# EAGLE design ardumsx (EAGLE 9.0.1)
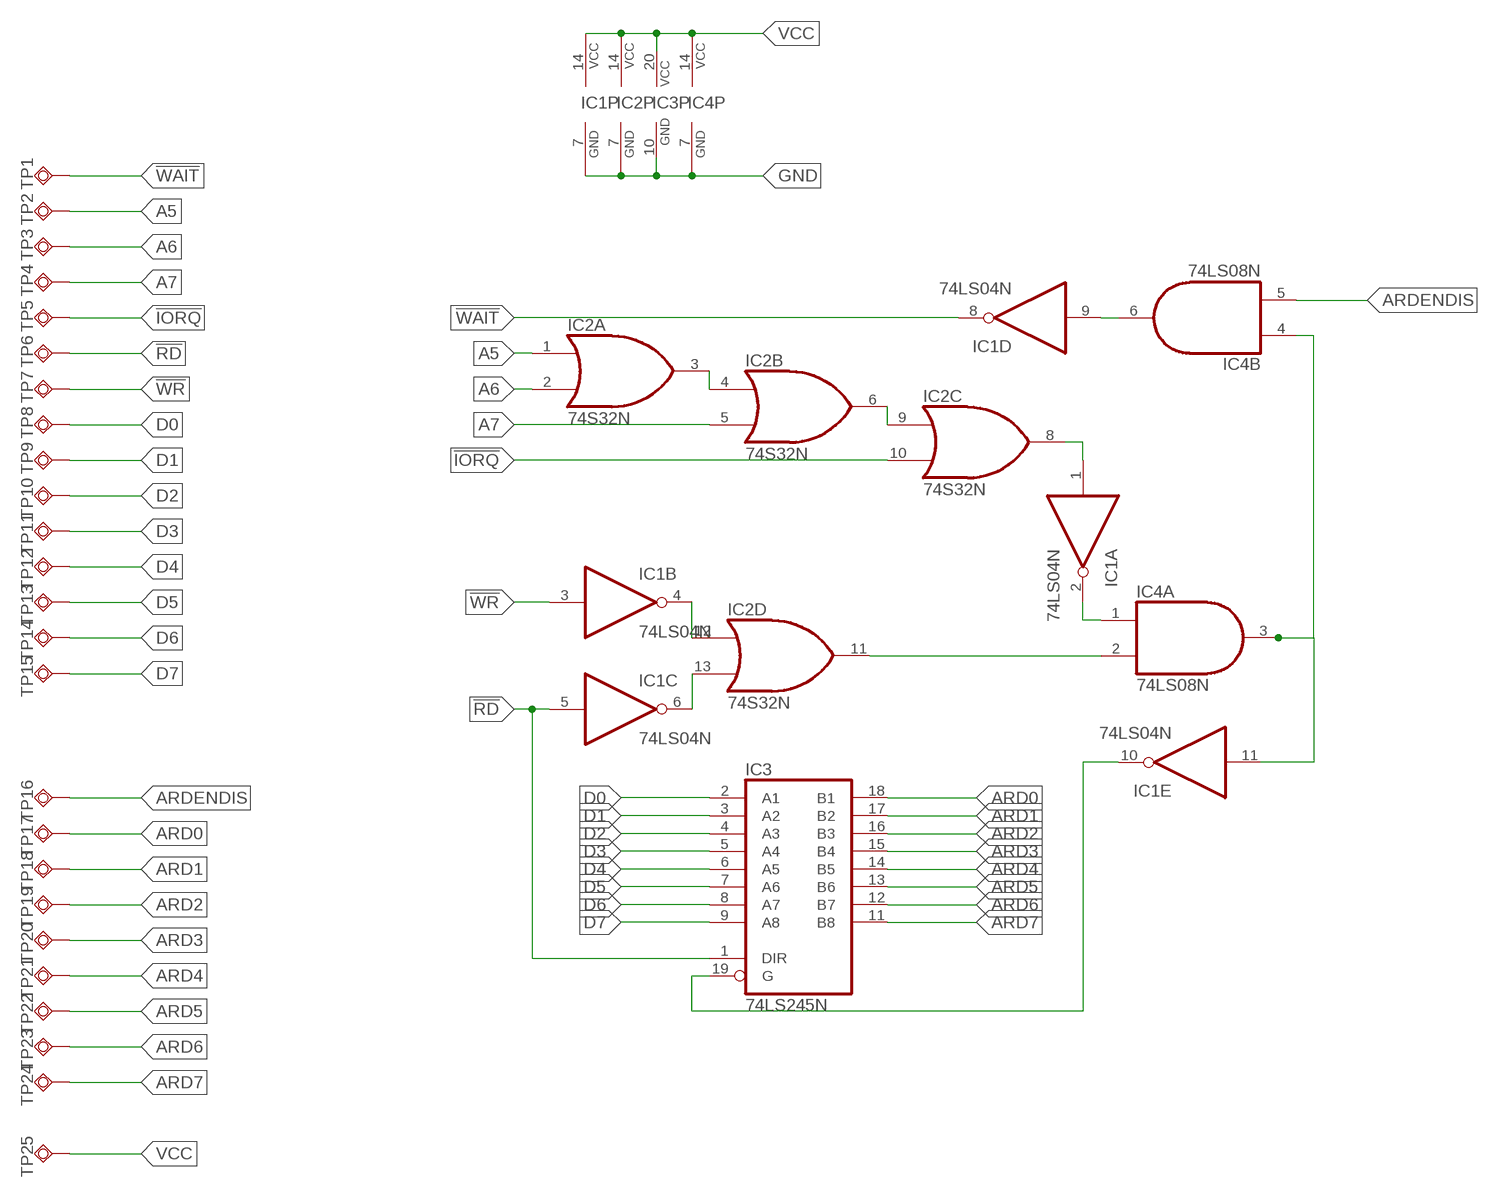
[diagram p0: schematic, sheet 1]

## Parts
IC1  74LS04N  [DIL14]
IC2  74S32N  [DIL14]
IC3  74LS245N  [DIL20]
IC4  74LS08N  [DIL14]
TP1  TPSQTP17R  [TP17R]
TP2  TPSQTP17R  [TP17R]
TP3  TPSQTP17R  [TP17R]
TP4  TPSQTP17R  [TP17R]
TP5  TPSQTP17R  [TP17R]
TP6  TPSQTP17R  [TP17R]
TP7  TPSQTP17R  [TP17R]
TP8  TPSQTP17R  [TP17R]
TP9  TPSQTP17R  [TP17R]
TP10  TPSQTP17R  [TP17R]
TP11  TPSQTP17R  [TP17R]
TP12  TPSQTP17R  [TP17R]
TP13  TPSQTP17R  [TP17R]
TP14  TPSQTP17R  [TP17R]
TP15  TPSQTP17R  [TP17R]
TP16  TPSQTP17R  [TP17R]
TP17  TPSQTP17R  [TP17R]
TP18  TPSQTP17R  [TP17R]
TP19  TPSQTP17R  [TP17R]
TP20  TPSQTP17R  [TP17R]
TP21  TPSQTP17R  [TP17R]
TP22  TPSQTP17R  [TP17R]
TP23  TPSQTP17R  [TP17R]
TP24  TPSQTP17R  [TP17R]
TP25  TPSQTP17R  [TP17R]

## Nets
!ENABLE: IC1.10(E:O) IC3.19(G)
!IORQ: IC2.10(C:I1) TP5.TP
!RD: IC1.5(C:I) IC3.1(DIR) TP6.TP
!WAIT: IC1.8(D:O) TP1.TP
!WR: IC1.3(B:I) TP7.TP
A5: IC2.1(A:I0) TP2.TP
A6: IC2.2(A:I1) TP3.TP
A7: IC2.5(B:I1) TP4.TP
ARD0: IC3.18(B1) TP17.TP
ARD1: IC3.17(B2) TP18.TP
ARD2: IC3.16(B3) TP19.TP
ARD3: IC3.15(B4) TP20.TP
ARD4: IC3.14(B5) TP21.TP
ARD5: IC3.13(B6) TP22.TP
ARD6: IC3.12(B7) TP23.TP
ARD7: IC3.11(B8) TP24.TP
ARDENDIS: IC4.5(B:I1) TP16.TP
D0: IC3.2(A1) TP8.TP
D1: IC3.3(A2) TP9.TP
D2: IC3.4(A3) TP10.TP
D3: IC3.5(A4) TP11.TP
D4: IC3.6(A5) TP12.TP
D5: IC3.7(A6) TP13.TP
D6: IC3.8(A7) TP14.TP
D7: IC3.9(A8) TP15.TP
GND: IC1.7(P:GND) IC2.7(P:GND) IC3.10(GND) IC4.7(P:GND)
N$3: IC2.3(A:O) IC2.4(B:I0)
N$5: IC2.6(B:O) IC2.9(C:I0)
N$7: IC1.1(A:I) IC2.8(C:O)
N$10: IC1.4(B:O) IC2.12(D:I0)
N$11: IC1.6(C:O) IC2.13(D:I1)
N$12: IC1.2(A:O) IC4.1(A:I0)
N$13: IC2.11(D:O) IC4.2(A:I1)
N$14: IC1.11(E:I) IC4.3(A:O) IC4.4(B:I0)
N$15: IC1.9(D:I) IC4.6(B:O)
VCC: IC1.14(P:VCC) IC2.14(P:VCC) IC3.20(VCC) IC4.14(P:VCC) TP25.TP
Unconnected: IC1.12(F:O) IC1.13(F:I) IC4.8(C:O) IC4.9(C:I0) IC4.10(C:I1) IC4.11(D:O) IC4.12(D:I0) IC4.13(D:I1)

## Library data of the parts
IC1 = 74xx-us:74*04: Hex INVERTER
IC2 = 74xx-us:74*32: Quad 2-input OR gate
IC3 = 74xx-eu:74*245: Octal BUS TRANSCEIVER, 3-state
IC4 = 74xx-us:74*08: Quad 2-input AND gate
TP1-TP25 = testpad:TPSQ: Test pad

## Board
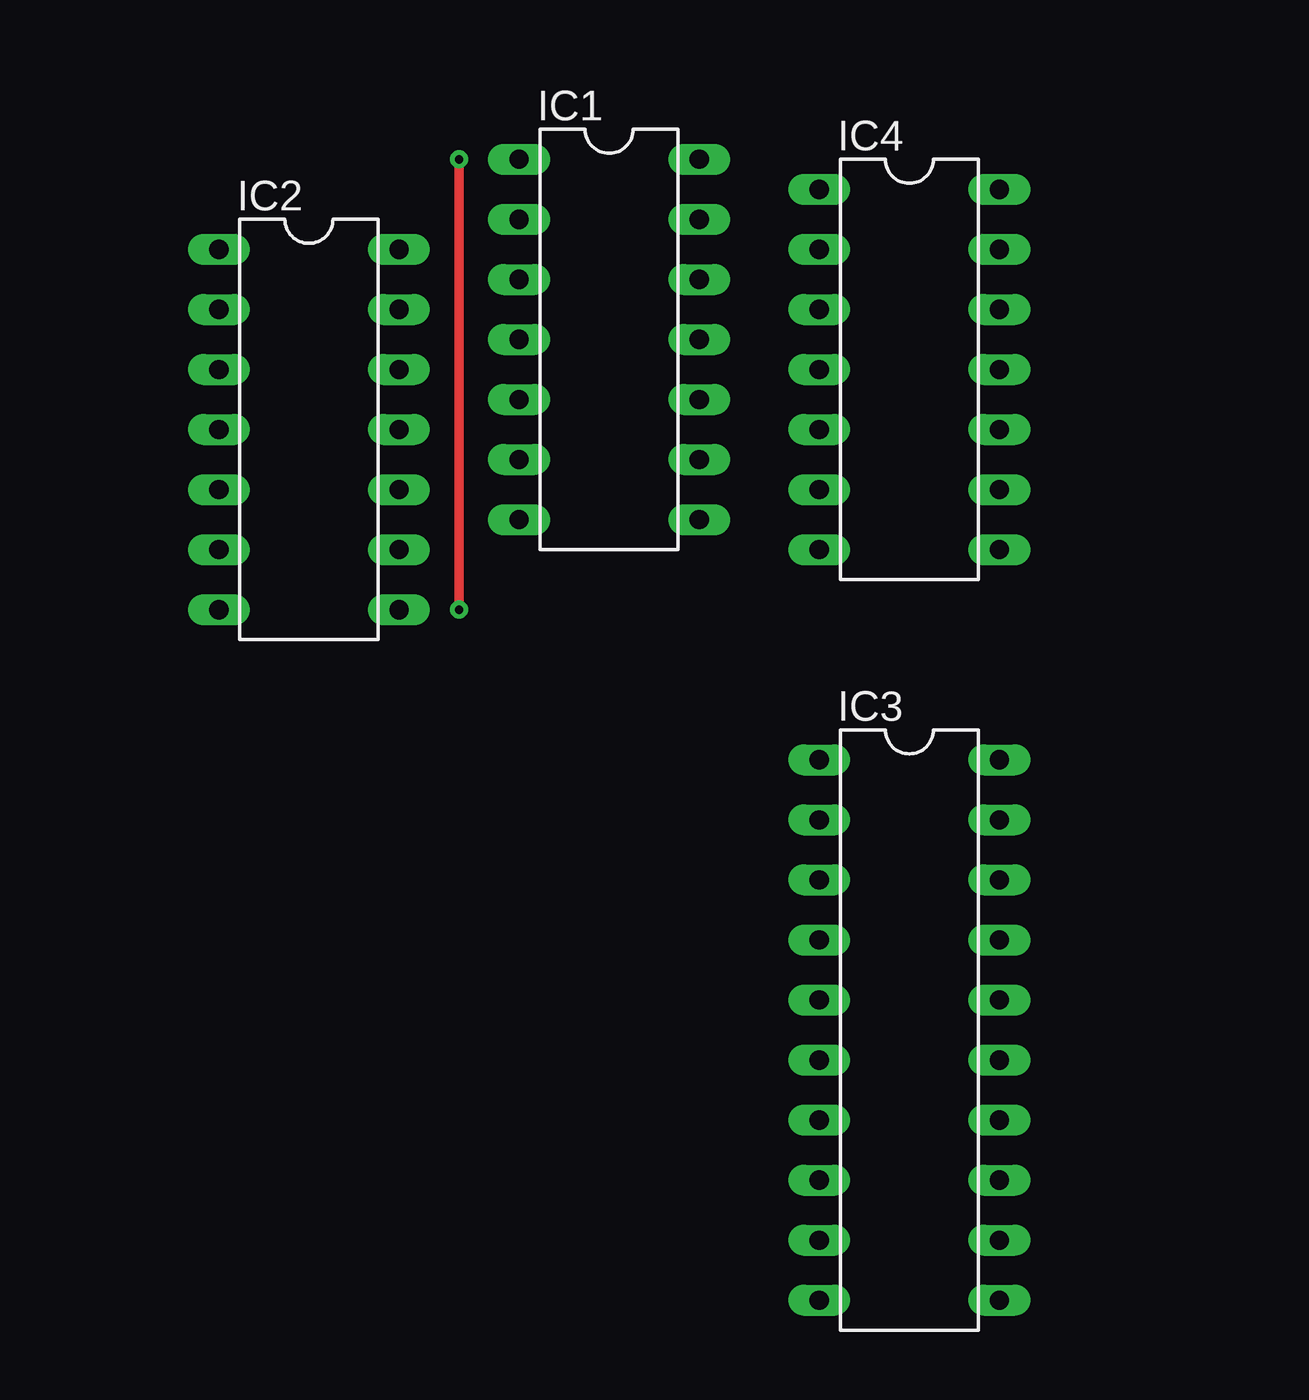
[diagram p1: board, top side]
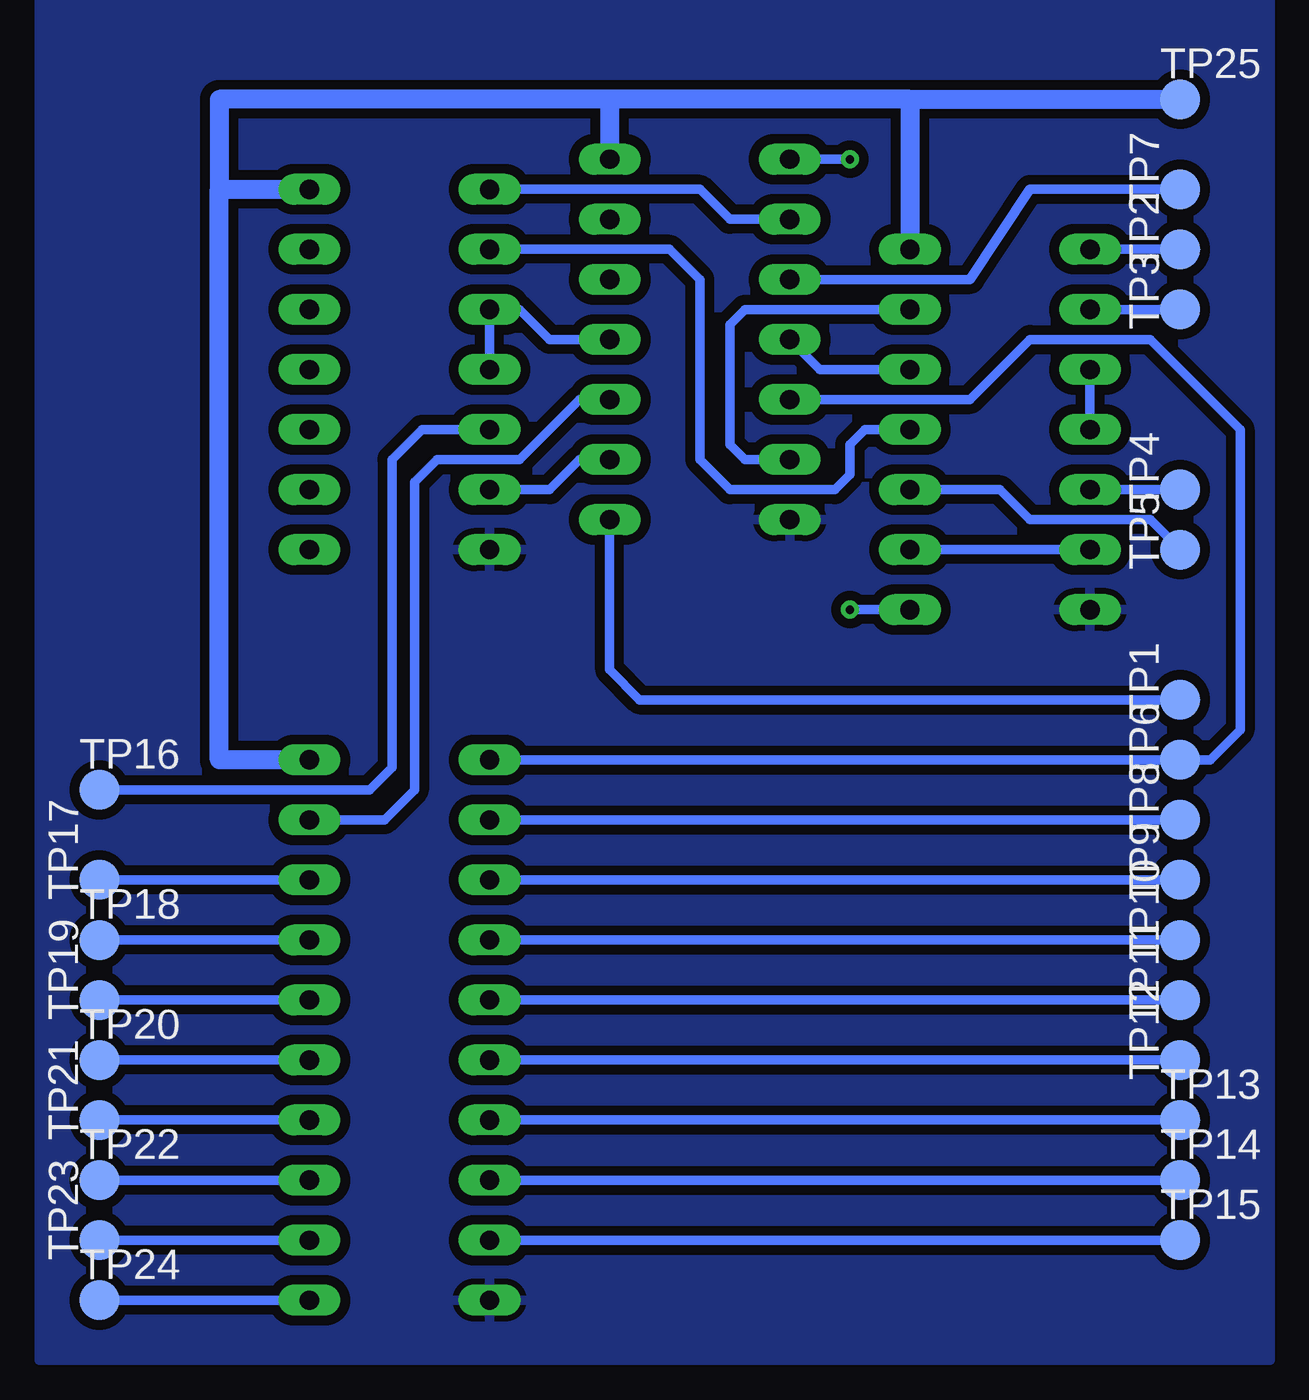
[diagram p2: board, bottom side, seen from below]

No outline drawn. Coordinates in mm, seen from the top.
Copper layers (1*16): Top 0.035mm / dielectric 1.5mm / Bottom 0.035mm
Design rules "default": minimum track width 6mil, minimum drill 0.35mm, track to track 6mil, track to pad 6mil, pad to pad 6mil, via to via 6mil, smd to smd 6mil, copper to edge 40mil, drill to drill 6mil, minimum pad ring 10mil, minimum via ring 8mil, stop-mask expansion 4mil, vias tented up to drill 0mil, thermal gap 10mil

### Footprints (pad centres in the part's own frame; a part is rotated, then mirrored left to right if it is on the bottom)
DIL14 = drill 0.813 long: 1 -7.62,-3.81; 2 -5.08,-3.81; 3 -2.54,-3.81; 4 0,-3.81; 5 2.54,-3.81; 6 5.08,-3.81; 7 7.62,-3.81; 8 7.62,3.81; 9 5.08,3.81; 10 2.54,3.81; 11 0,3.81; 12 -2.54,3.81; 13 -5.08,3.81; 14 -7.62,3.81
DIL20 = drill 0.813 long: 1 -11.43,-3.81; 2 -8.89,-3.81; 3 -6.35,-3.81; 4 -3.81,-3.81; 5 -1.27,-3.81; 6 1.27,-3.81; 7 3.81,-3.81; 8 6.35,-3.81; 9 8.89,-3.81; 10 11.43,-3.81; 11 11.43,3.81; 12 8.89,3.81; 13 6.35,3.81; 14 3.81,3.81; 15 1.27,3.81; 16 -1.27,3.81; 17 -3.81,3.81; 18 -6.35,3.81; 19 -8.89,3.81; 20 -11.43,3.81
TP17R = smd 1.7 x 1.7: TP 0,0

### Placement (x,y rotation side)
IC1  31.75,50.8 270 top
IC2  19.05,46.99 270 top
IC3  44.45,21.59 270 top
IC4  44.45,49.53 270 top
TP1  11.43,35.56 90 bottom
TP2  11.43,54.61 90 bottom
TP3  11.43,52.07 90 bottom
TP4  11.43,44.45 90 bottom
TP5  11.43,41.91 90 bottom
TP6  11.43,33.02 90 bottom
TP7  11.43,57.15 90 bottom
TP8  11.43,30.48 90 bottom
TP9  11.43,27.94 90 bottom
TP10  11.43,25.4 90 bottom
TP11  11.43,22.86 90 bottom
TP12  11.43,20.32 90 bottom
TP13  11.43,17.78 0 bottom
TP14  11.43,15.24 0 bottom
TP15  11.43,12.7 0 bottom
TP16  57.15,31.75 0 bottom
TP17  57.15,27.94 90 bottom
TP18  57.15,25.4 0 bottom
TP19  57.15,22.86 90 bottom
TP20  57.15,20.32 0 bottom
TP21  57.15,17.78 90 bottom
TP22  57.15,15.24 0 bottom
TP23  57.15,12.7 90 bottom
TP24  57.15,10.16 0 bottom
TP25  11.43,60.96 0 bottom

### Tracks (layer width: path | path; a pad name or v marks a point on that pad's centre or on a via)
!ENABLE
  Bottom 0.406: IC3.19 45.09,30.48 43.81,31.75 43.81,44.77 42.86,45.72 39.37,45.72 36.83,48.26 IC1.10
!IORQ
  Bottom 0.406: IC2.10 19.05,44.45 17.78,43.18 12.7,43.18 TP5.TP
!RD
  Bottom 0.406: IC3.1 TP6.TP 10.16,33.02 8.89,34.29 8.89,46.99 12.7,50.8 17.78,50.8 20.32,48.26 IC1.5
!WAIT
  Bottom 0.406: TP1.TP 34.29,35.56 35.56,36.83 IC1.8
!WR
  Bottom 0.406: IC1.3 20.32,53.34 17.78,57.15 TP7.TP
A5
  Bottom 0.406: IC2.1 TP2.TP
A6
  Bottom 0.406: IC2.2 TP3.TP
A7
  Bottom 0.406: IC2.5 TP4.TP
ARD0
  Bottom 0.406: IC3.18 TP17.TP
ARD1
  Bottom 0.406: IC3.17 TP18.TP
ARD2
  Bottom 0.406: IC3.16 TP19.TP
ARD3
  Bottom 0.406: IC3.15 TP20.TP
ARD4
  Bottom 0.406: IC3.14 TP21.TP
ARD5
  Bottom 0.406: IC3.13 TP22.TP
ARD6
  Bottom 0.406: IC3.12 TP23.TP
ARD7
  Bottom 0.406: IC3.11 TP24.TP
ARDENDIS
  Bottom 0.406: IC4.5 43.5,46.99 44.77,45.72 44.77,32.7 45.72,31.75 TP16.TP
D0
  Bottom 0.406: IC3.2 TP8.TP
D1
  Bottom 0.406: IC3.3 TP9.TP
D2
  Bottom 0.406: IC3.4 TP10.TP
D3
  Bottom 0.406: IC3.5 TP11.TP
D4
  Bottom 0.406: IC3.6 TP12.TP
D5
  Bottom 0.406: IC3.7 TP13.TP
D6
  Bottom 0.406: IC3.8 TP14.TP
D7
  Bottom 0.406: IC3.9 TP15.TP
GND
  pour Bottom (isolate 0.406): 7.62,69.85 7.62,7.62 59.69,7.62 59.69,69.85
N$3
  Bottom 0.406: IC2.3 IC2.4
N$5
  Bottom 0.406: IC2.6 IC2.9
N$7  (via drill 0.35)
  Top 0.406: v25.4,39.37 v25.4,58.42
  Bottom 0.406: IC2.8 v25.4,39.37 | IC1.1 v25.4,58.42
N$10
  Bottom 0.406: IC2.12 26.67,49.53 IC1.4
N$11
  Bottom 0.406: IC2.13 29.84,52.07 30.48,51.44 30.48,46.35 29.84,45.72 IC1.6
N$12
  Bottom 0.406: IC1.2 30.48,55.88 31.75,57.15 IC4.1
N$13
  Bottom 0.406: IC2.11 24.77,46.99 25.4,46.35 25.4,45.09 26.04,44.45 30.48,44.45 31.75,45.72 31.75,53.34 33.02,54.61 IC4.2
N$14
  Bottom 0.406: IC1.11 38.1,50.8 39.37,52.07 IC4.3 IC4.4
N$15
  Bottom 0.406: IC1.9 36.83,45.72 38.1,44.45 IC4.6
VCC
  Bottom 0.813: IC3.20 52.07,33.02 52.07,57.15 | 52.07,57.15 52.07,60.96 35.56,60.96 | 52.07,57.15 IC4.14 | 22.86,60.96 IC2.14 | 22.86,60.96 35.56,60.96 | 35.56,60.96 IC1.14 | 22.86,60.96 TP25.TP